# EAGLE design dekatron-sim-4017-a2 (EAGLE 6.4)
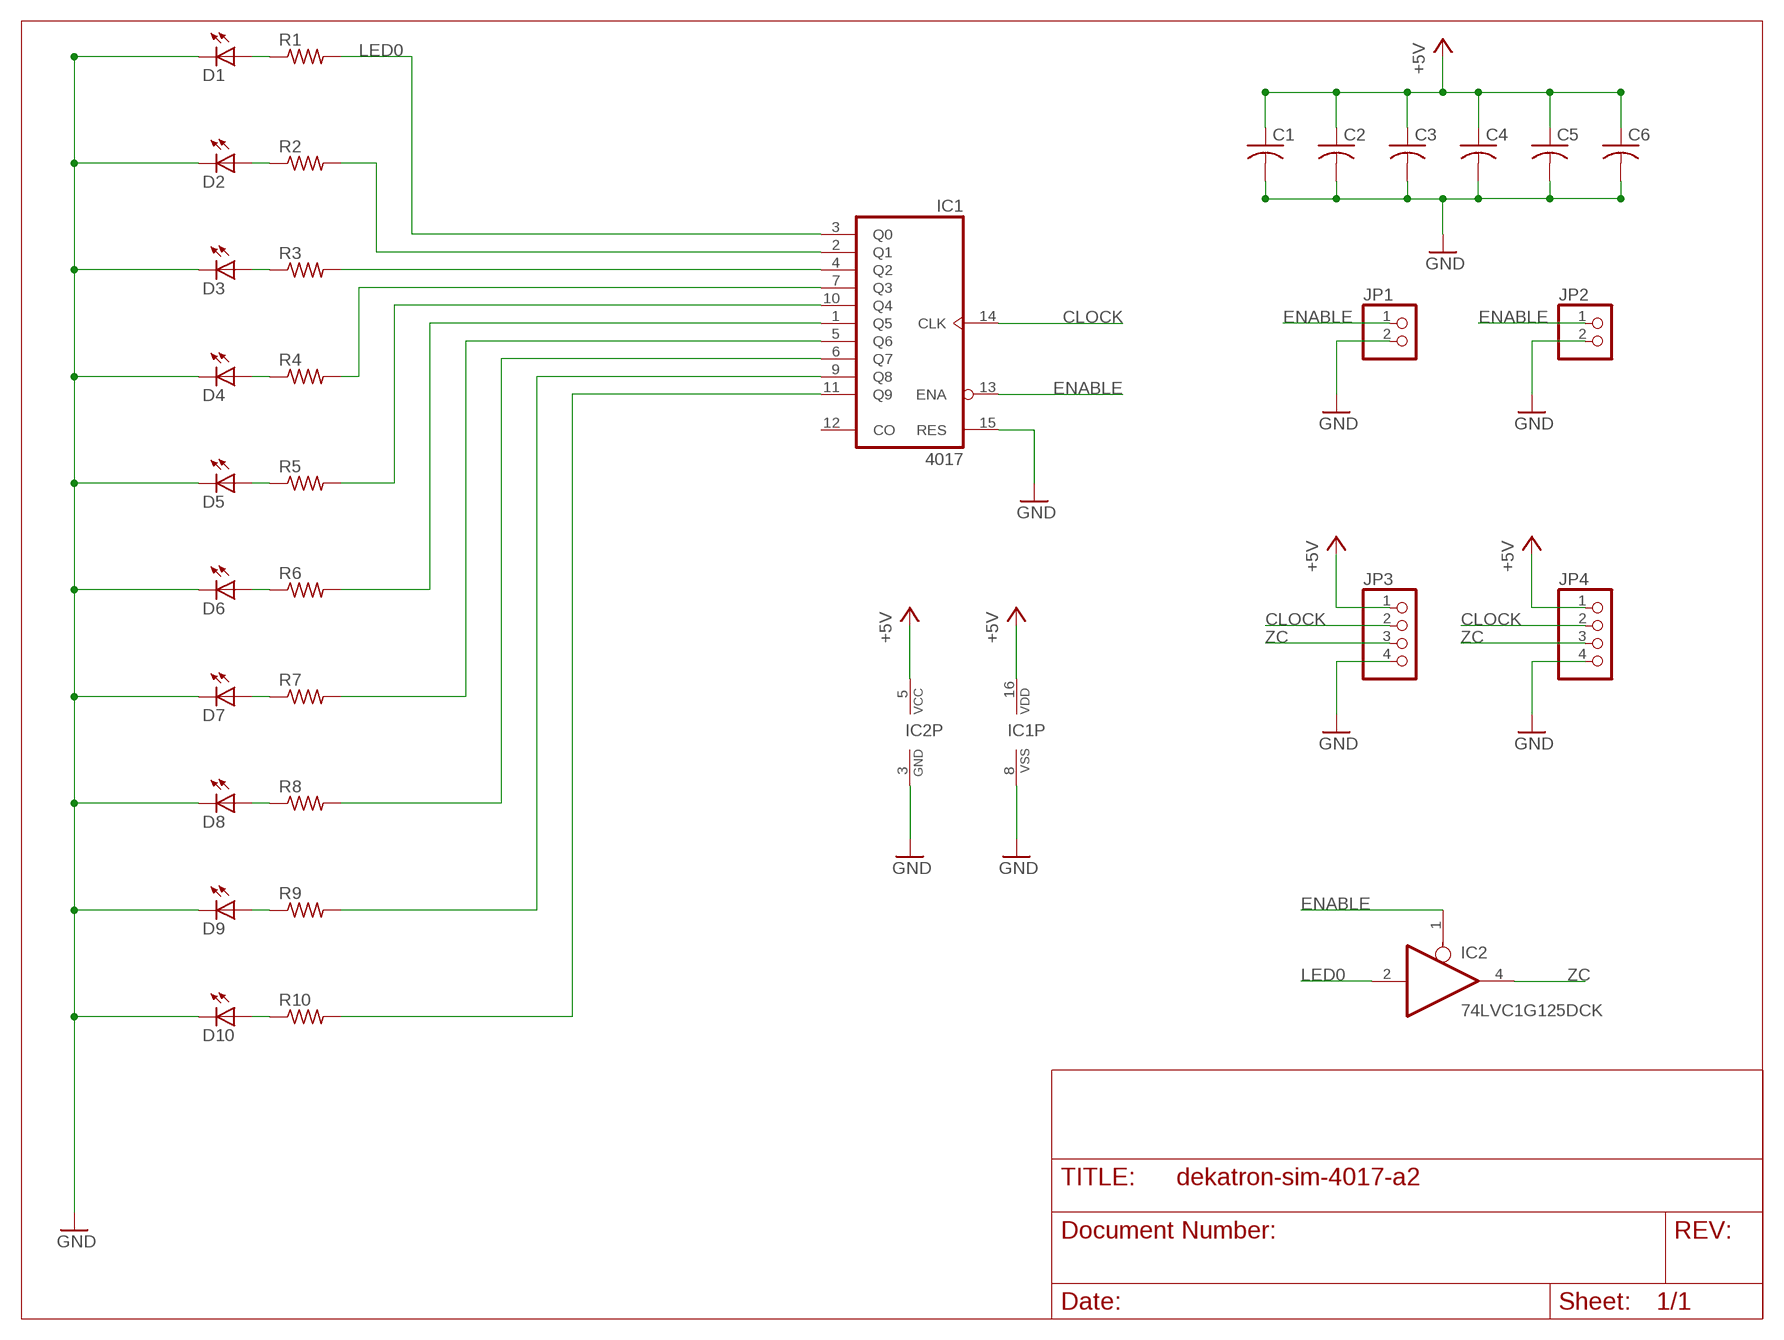
[diagram p0: schematic, sheet 1]

## Parts
C1  C-USC0805  [C0805]
C2  C-USC0805  [C0805]
C3  C-USC0805  [C0805]
C4  C-USC0805  [C0805]
C5  C-USC0805  [C0805]
C6  C-USC0805  [C0805]
D1  RED  LEDCHIP-LED0603  [CHIP-LED0603]
D2  RED  LEDCHIP-LED0603  [CHIP-LED0603]
D3  RED  LEDCHIP-LED0603  [CHIP-LED0603]
D4  RED  LEDCHIP-LED0603  [CHIP-LED0603]
D5  RED  LEDCHIP-LED0603  [CHIP-LED0603]
D6  RED  LEDCHIP-LED0603  [CHIP-LED0603]
D7  RED  LEDCHIP-LED0603  [CHIP-LED0603]
D8  RED  LEDCHIP-LED0603  [CHIP-LED0603]
D9  RED  LEDCHIP-LED0603  [CHIP-LED0603]
D10  RED  LEDCHIP-LED0603  [CHIP-LED0603]
IC1  4017  [TSSOP16]
IC2  74LVC1G125DCK  [SC70-5]
JP1  PINHD-1X2  [1X02]
JP2  PINHD-1X2  [1X02]
JP3  PINHD-1X4  [1X04]
JP4  PINHD-1X4  [1X04]
R1  R-US_R0603  [R0603]
R2  R-US_R0603  [R0603]
R3  R-US_R0603  [R0603]
R4  R-US_R0603  [R0603]
R5  R-US_R0603  [R0603]
R6  R-US_R0603  [R0603]
R7  R-US_R0603  [R0603]
R8  R-US_R0603  [R0603]
R9  R-US_R0603  [R0603]
R10  R-US_R0603  [R0603]

## Nets
+5V: C1.1 C2.1 C3.1 C4.1 C5.1 C6.1 IC1.16(VDD) IC2.5(VCC) JP3.1 JP4.1
CLOCK: IC1.14(CLK) JP3.2 JP4.2
ENABLE: IC1.13(ENA) IC2.1(OE) JP1.1 JP2.1
GND: C1.2 C2.2 C3.2 C4.2 C5.2 C6.2 D1.C D2.C D3.C D4.C D5.C D6.C D7.C D8.C D9.C D10.C IC1.8(VSS) IC1.15(RES) IC2.3(GND) JP1.2 JP2.2 JP3.4 JP4.4
LED0: IC1.3(Q0) IC2.2(I) R1.2
LED1: IC1.2(Q1) R2.2
LED3: IC1.7(Q3) R4.2
LED4: IC1.10(Q4) R5.2
LED5: IC1.1(Q5) R6.2
LED6: IC1.5(Q6) R7.2
LED7: IC1.6(Q7) R8.2
LED8: IC1.9(Q8) R9.2
LED9: IC1.11(Q9) R10.2
N$1: IC1.4(Q2) R3.2
N$2: D10.A R10.1
N$3: D9.A R9.1
N$4: D8.A R8.1
N$5: D7.A R7.1
N$6: D6.A R6.1
N$7: D5.A R5.1
N$8: D4.A R4.1
N$9: D3.A R3.1
N$10: D2.A R2.1
N$11: D1.A R1.1
ZC: IC2.4(O) JP3.3 JP4.3
Unconnected: IC1.12(CO)

## Library data of the parts
C1-C6 = resistor:C-US: CAPACITOR, American symbol
D1-D10 = led:LED: LED OSRAM: - CHIPLED LG R971, LG N971, LY N971, LG Q971, LY Q971, LO R971, LY R971 LH N974, LH R974 LS Q976, LO Q976, LY Q976 LO Q996 - Hyper CHIPLED LW Q18S LB Q993, LB Q99A, LB R99A - SideLED LS A670, LO A670, LY A670, LG A670, LP A670 LB A673, LV A673, LT A673, LW A673 LH A674 LY A675 LS A676, LA A676, LO A676, LY A676, LW A676 LS A679, LY A679, LG A679 - Hyper Micro SIDELED® LS Y876, LA Y876, LO Y876, LY Y876 LT Y87S - SmartLED LW L88C, LW L88S LB L89C, LB L89S, LG L890 LS L89K, LO L89K, LY L89K LS L896, LA L896, LO L896, LY L896 - TOPLED LS T670, LO T670, LY T670, LG T670, LP T670 LSG T670, LSP T670, LSY T670, LOP T670, LYG T670 LG T671, LOG T671, LSG T671 LB T673, LV T673, LT T673, LW T673 LH T674 LS T676, LA T676, LO T676, LY T676, LB T676, LH T676, LSB T676, LW T676 LB T67C, LV T67C, LT T67C, LS T67K, LO T67K, LY T67K, LW E67C LS E67B, LA E67B, LO E67B, LY E67B, LB E67C, LV E67C, LT E67C LW T67C LS T679, LY T679, LG T679 LS T770, LO T770, LY T770, LG T770, LP T770 LB T773, LV T773, LT T773, LW T773 LH T774 LS E675, LA E675, LY E675, LS T675 LS T776, LA T776, LO T776, LY T776, LB T776 LHGB T686 LT T68C, LB T68C - Hyper Mini TOPLED® LB M676 - Mini TOPLED Santana® LG M470 LS M47K, LO M47K, LY M47K Source: http://www.osram.convergy.de LUXEON: - LUMILED® LXK2-PW12-R00, LXK2-PW12-S00, LXK2-PW14-U00, LXK2-PW14-V00 LXK2-PM12-R00, LXK2-PM12-S00, LXK2-PM14-U00 LXK2-PE12-Q00, LXK2-PE12-R00, LXK2-PE12-S00, LXK2-PE14-T00, LXK2-PE14-U00 LXK2-PB12-K00, LXK2-PB12-L00, LXK2-PB12-M00, LXK2-PB14-N00, LXK2-PB14-P00, LXK2-PB14-Q00 LXK2-PR12-L00, LXK2-PR12-M00, LXK2-PR14-Q00, LXK2-PR14-R00 LXK2-PD12-Q00, LXK2-PD12-R00, LXK2-PD12-S00 LXK2-PH12-R00, LXK2-PH12-S00 LXK2-PL12-P00, LXK2-PL12-Q00, LXK2-PL12-R00 Source: www.luxeon.com KINGBRIGHT: KA-3528ASYC Source: www.kingbright.com
IC1 = 40xx:4017: COUNTER/DIVIDER
IC2 = 74xx-little-us:74*1G125: Single Bus Buffer Gate with 3-State Output
JP1 JP2 = pinhead:PINHD-1X2: PIN HEADER
JP3 JP4 = pinhead:PINHD-1X4: PIN HEADER
R1-R10 = resistor:R-US_: RESISTOR, American symbol

## Board
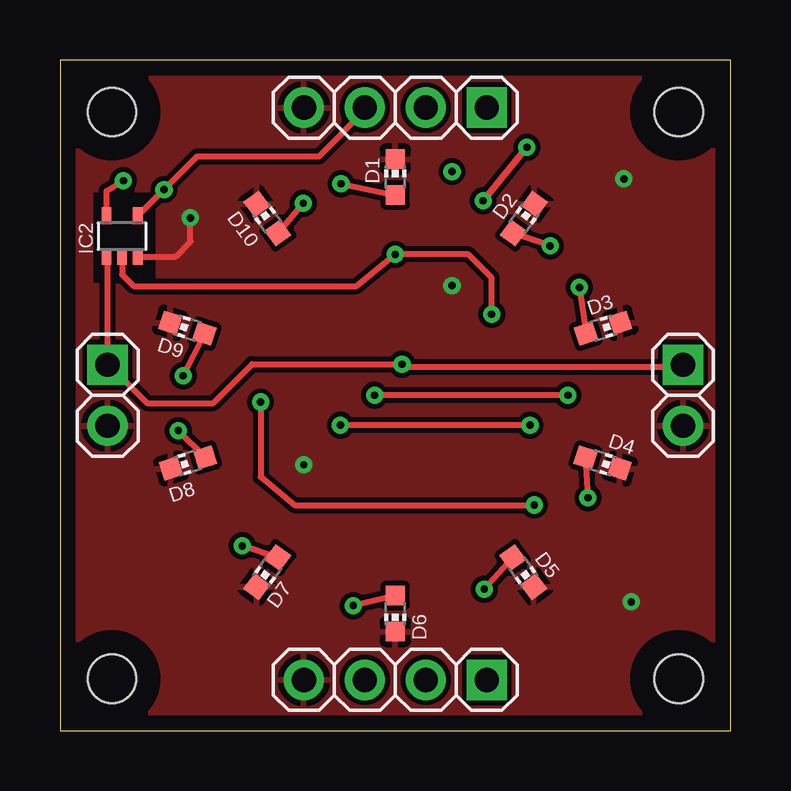
[diagram p1: board, top side]
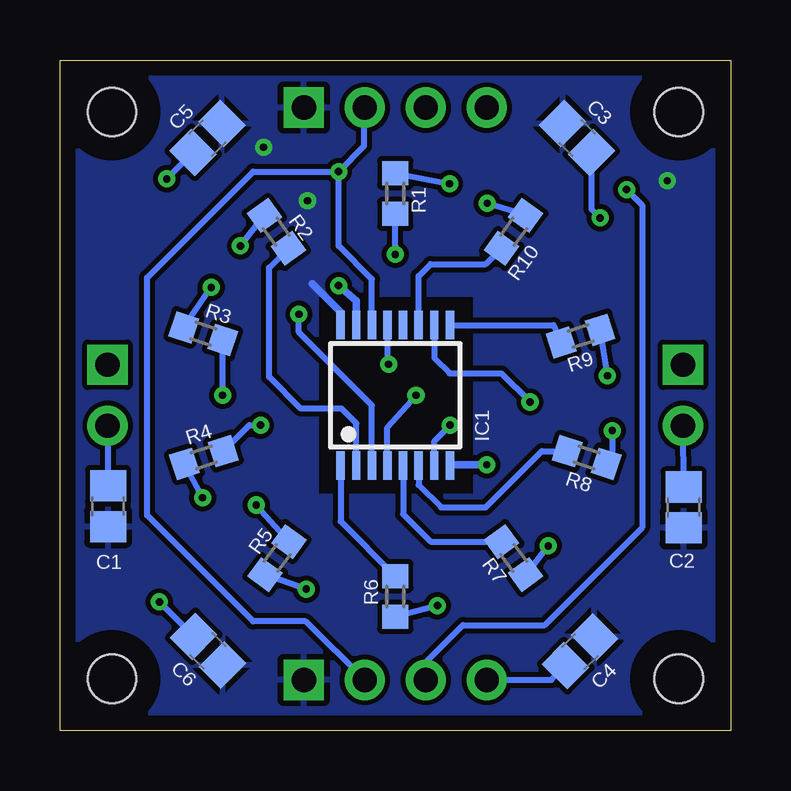
[diagram p2: board, bottom side, seen from below]

Size 27.94 x 27.94 mm. Coordinates in mm from the lower left corner, seen from the top.
Outline: 27.94,27.94 0,27.94 0,0 27.94,0 27.94,27.94
Copper layers (1*16): Top 0.035mm / dielectric 1.5mm / Bottom 0.035mm
Design rules "default *": minimum track width 8mil, minimum drill 12mil, track to track 8mil, track to pad 10mil, pad to pad 10mil, via to via 8mil, smd to smd 8mil, copper to edge 25mil, drill to drill 8mil, minimum pad ring 10mil, minimum via ring 8mil, stop-mask expansion 4mil, vias tented up to drill 0mil, thermal gap 10mil
Holes 2.01 mm at 2.16,2.16 25.78,2.16 25.78,25.78 2.16,25.78
tRestrict: area 23.8,0.2 to 27.8,4.2; area 23.8,23.8 to 27.8,27.8; area 0.2,23.8 to 4.2,27.8; area 0.2,0.2 to 4.2,4.2; area 1.4,18.7 to 4,22.4
bRestrict: area 23.8,0.2 to 27.8,4.2; area 23.8,23.8 to 27.8,27.8; area 0.2,23.8 to 4.2,27.8; area 0.2,0.2 to 4.2,4.2; area 10.7,9.9 to 17.1,18.1

### Footprints (pad centres in the part's own frame; a part is rotated, then mirrored left to right if it is on the bottom)
C0805 = smd 1.3 x 1.5: 1 -0.85,0; 2 0.85,0
CHIP-LED0603 = smd 0.8 x 0.8: A 0,-0.75; C 0,0.75
TSSOP16 = smd 0.35 x 1.2: 1 -2.275,-2.925; 2 -1.625,-2.925; 3 -0.975,-2.925; 4 -0.325,-2.925; 5 0.325,-2.925; 6 0.975,-2.925; 7 1.625,-2.925; 8 2.275,-2.925; 9 2.275,2.925; 10 1.625,2.925; 11 0.975,2.925; 12 0.325,2.925; 13 -0.325,2.925; 14 -0.975,2.925; 15 -1.625,2.925; 16 -2.275,2.925
SC70-5 = smd 0.4 x 0.7: 1 -0.65,-0.85; 2 0,-0.85; 3 0.65,-0.85; 4 0.65,0.85; 5 -0.65,0.85
1X02 = drill 1.016 pad 1.676 square: 1 -1.27,0 | drill 1.016 pad 1.676: 2 1.27,0
1X04 = drill 1.016 pad 1.676 square: 1 -3.81,0 | drill 1.016 pad 1.676: 2 -1.27,0; 3 1.27,0; 4 3.81,0
R0603 = smd 1 x 1.1: 1 -0.85,0; 2 0.85,0

### Placement (x,y rotation side)
C1  25.93,9.35 90 bottom
C2  1.96,9.3 90 bottom
C3  6.4,24.69 315 bottom
C4  6.27,3.3 225 bottom
C5  21.79,24.69 225 bottom
C6  21.77,3.33 135 bottom
D1  13.97,23.06 0 top
D2  19.33,21.34 324 top
D3  22.63,16.76 288 top
D4  22.61,11.15 252 top
D5  19.3,6.6 216 top
D6  13.97,4.88 180 top
D7  8.64,6.6 144 top
D8  5.33,11.15 108 top
D9  5.31,16.76 72 top
D10  8.64,21.34 36 top
IC1  13.97,13.97 0 bottom
IC2  2.59,20.6 0 top
JP1  1.98,13.97 270 top
JP2  25.96,13.97 270 top
JP3  13.97,25.96 180 top
JP4  13.97,2.11 180 top
R1  13.97,22.38 270 bottom
R2  18.92,20.78 306 bottom
R3  21.97,16.54 342 bottom
R4  21.95,11.38 18 bottom
R5  18.9,7.19 54 bottom
R6  13.97,5.59 90 bottom
R7  9.04,7.19 126 bottom
R8  5.99,11.38 162 bottom
R9  6.25,16.43 198 bottom
R10  9.04,20.78 234 bottom

### Tracks (layer width: path | path; a pad name or v marks a point on that pad's centre or on a via)
+5V  (via drill 0.3)
  Top 0.254: IC2.5 1.94,22.49 v2.64,22.91
  Top 0.305: v19.46,24.31 v17.63,22.07
  Bottom 0.305: IC1.16 16.25,17.44 17.42,18.62
  pour Bottom: 27.94,0 0,0 0,27.94 27.94,27.94
CLOCK  (via drill 0.3)
  Bottom 0.254: v16.33,23.29 16.33,20.19 14.95,18.81 IC1.14 | JP4.2 17.7,4.55 19.89,4.55 24.31,8.97 24.31,18.87 19.89,23.29 v16.33,23.29 | v16.33,23.29 15.27,24.36 15.27,25.93 JP3.2
ENABLE  (via drill 0.3)
  Top 0.254: IC2.1 1.98,19.71 JP1.1 2.01,15.27 3.63,13.64 6.38,13.64 8,15.27 v14.25,15.27 14.38,15.16 25.63,15.16 JP2.1
  Bottom 0.254: IC1.13 14.29,15.31 v14.25,15.27
GND  (via drill 0.3)
  Top 0.254: IC2.3 4.81,19.75 5.44,20.37 v5.44,21.36
  Bottom 0.254: C2.2 JP1.2 | JP4.4 7.47,2.11 C4.2 | C6.2 v23.8,5.36 | v23.8,5.36 | C5.2 v23.5,22.99 | C3.2 5.8,21.73 v5.44,21.36 | C1.2 25.93,12.68 JP2.2
  Bottom 0.305: IC1.15 15.6,17.91 v16.33,18.54 | IC1.8 11.67,11.07 v10.16,11.07
  pour Top: 27.94,0 0,0 0,27.94 27.94,27.94
LED0  (via drill 0.3)
  Top 0.254: IC2.2 2.59,19 3.07,18.52 12.34,18.52 v13.97,19.84 17.02,19.84 17.98,18.87 v17.98,17.35
  Bottom 0.254: IC1.3 14.95,13.55 17.98,16.59 v17.98,17.35 | v13.97,19.84 R1.2
LED1
  Bottom 0.254: IC1.2 15.6,12.8 16.2,13.41 17.91,13.41 19.23,14.73 19.23,19.29 R2.2
LED3  (via drill 0.3)
  Top 0.254: v11.68,12.72 19.02,12.72 v19.58,12.72
  Bottom 0.254: IC1.7 12.35,12.06 v11.68,12.72 | R4.2 20.05,12.72 v19.58,12.72
LED4  (via drill 0.3)
  Top 0.254: v8.36,13.69 8.36,10.57 9.78,9.4 v19.76,9.4
  Bottom 0.254: IC1.10 12.35,15.52 11.71,14.88 9.55,14.88 v8.36,13.69 | v19.76,9.4 R5.2
LED5
  Bottom 0.254: IC1.1 16.25,8.71 R6.2
LED6
  Bottom 0.254: IC1.5 13.64,9.02 12.5,7.88 R7.2
LED7
  Bottom 0.254: IC1.6 12.99,10.23 12.06,9.3 10.21,9.3 7.87,11.64 R8.2
LED8
  Bottom 0.254: IC1.9 7.37,16.89 R9.2
LED9
  Bottom 0.254: IC1.11 12.99,18.93 12.5,19.43 10.2,19.43 R10.2
N$1  (via drill 0.3)
  Top 0.254: v21.16,13.97 v13.11,13.97
  Bottom 0.254: IC1.4 14.29,12.63 v13.11,13.97 | v21.16,13.97 R3.2
N$2  (via drill 0.3)
  Top 0.254: v10.13,21.97 D10.A
  Bottom 0.254: R10.1 v10.13,21.97
N$3  (via drill 0.3)
  Top 0.254: v5.13,14.78 D9.A
  Bottom 0.254: R9.1 v5.13,14.78
N$4  (via drill 0.3)
  Top 0.254: D8.A v4.93,12.5
  Bottom 0.254: v4.93,12.5 4.93,11.38 R8.1
N$5  (via drill 0.3)
  Top 0.254: D7.A v7.59,7.7
  Bottom 0.254: v7.59,7.7 R7.1
N$6  (via drill 0.3)
  Top 0.254: D6.A v12.22,5.21
  Bottom 0.254: v12.22,5.21 R6.1
N$7  (via drill 0.3)
  Top 0.254: D5.A v17.68,5.89
  Bottom 0.254: v17.68,5.89 R5.1
N$8  (via drill 0.3)
  Top 0.254: D4.A v22,9.7
  Bottom 0.254: v22,9.7 R4.1
N$9  (via drill 0.3)
  Top 0.254: v21.64,18.47 D3.A
  Bottom 0.254: R3.1 v21.64,18.47
N$10  (via drill 0.3)
  Top 0.254: v20.42,20.19 D2.A
  Bottom 0.254: R2.1 v20.42,20.19
N$11  (via drill 0.3)
  Top 0.254: v11.71,22.78 D1.A
  Bottom 0.254: R1.1 v11.71,22.78
ZC  (via drill 0.3)
  Top 0.254: JP3.3 12.72,25.86 10.79,23.93 5.72,23.93 v4.33,22.54 IC2.4
  Bottom 0.254: v4.33,22.54 3.68,21.89 3.68,8.46 7.75,4.39 11.15,4.39 12.72,2.82 12.72,2.13 JP4.3

### Text on the board
Document: 0 | Dekatron Sim | 9 | 1 | 8 | 2 | 7 | 3 | 6 | 4 | 5